# Altium schematic sheet CAN.SchDoc
size A4; SheetNumber: 6; SheetTotal: 7
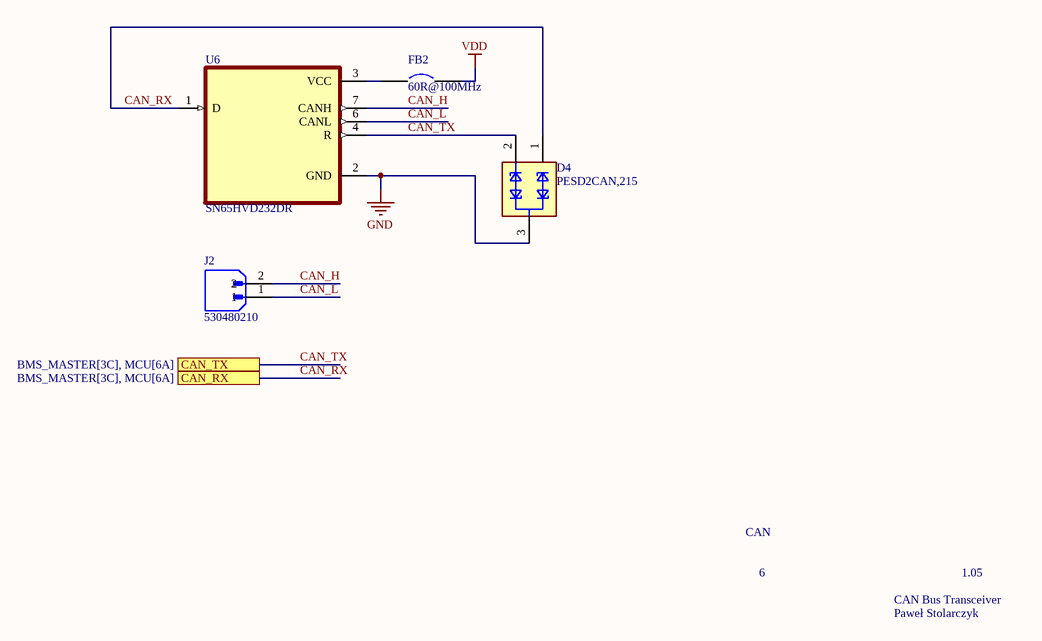
[diagram p0: CAN.SchDoc]

## Parts
D4  PESD2CAN,215  [SOT95P230X110-3N]
FB2  60R@100MHz  [0402]
J2  530480210  [MOLEX_530480210]
U6  SN65HVD232DR  [SOIC127P599X175-8N]

## Ports
CAN_RX (see BMS_MASTER[3C], MCU[6A]), CAN_TX (see BMS_MASTER[3C], MCU[6A])

## Nets
GND: D4.3 U6.2(GND)
VDD: FB2.2
CAN_H: J2.2 U6.7(CANH)
CAN_L: J2.1 U6.6(CANL)
CAN_RX: D4.1 U6.1(D) ; port CAN_RX
CAN_TX: D4.2 U6.4(R) ; port CAN_TX
NetFB2_1: FB2.1 U6.3(VCC)

## Notes on the sheet
- CAN
- 6
- CAN Bus Transceiver
- 1.05
- Paweł Stolarczyk

## Library data of the parts
D4 = PESD2CAN,215: ESD Suppressor Diode TVS Bi-Dir 24V Automotive 3-Pin SOT-23 T/R; MF: Nexperia USA Inc.; SnapEDA_Link: https://www.snapeda.com/parts/PESD2CAN,215/Nexperia/view-part/?ref=snap; Package: TO-236-3 Nexperia USA Inc.; MP: PESD2CAN,215; Check_prices: https://www.snapeda.com/parts/PESD2CAN,215/Nexperia/view-part/?ref=eda; Purchase-URL: https://pricing.snapeda.com/search/part/PESD2CAN,215/?ref=eda; Price: None; Value: *; Availability: In Stock
FB2 = Circuit Breaker: Published: 24-Mar-1999; LatestRevisionDate: 17-Jul-2002; LatestRevisionNote: Re-released for DXP Platform.; PackageReference: SPST-2; Publisher: Altium Limited; PackageDescription: Switch; 2 Leads
J2 = 530480210: Conn Shrouded Header (4 Sides) HDR 2 POS 1.25mm Solder RA Side Entry Thru-Hole PicoBladeâ„¢ Tray; MF: Molex; SnapEDA_Link: https://www.snapeda.com/parts/530480210/Molex/view-part/?ref=snap; Value: *; Purchase-URL: https://pricing.snapeda.com/search/part/530480210/?ref=eda; Check_prices: https://www.snapeda.com/parts/530480210/Molex/view-part/?ref=eda; Availability: In Stock; Price: None; MP: 530480210; Package: None
U6 = SN65HVD232DR: 3.3 V CAN Transceiver 8-SOIC -40 to 85; MF: Texas Instruments; Texas_Instruments-Purchase-URL: https://snapeda.com/shop?store=Texas+Instruments&id=184570; Price: None; Mouser-Purchase-URL: https://snapeda.com/shop?store=Mouser&id=184570; Availability: Good; Package: SOIC-8 Texas Instruments; SnapEDA_Link: https://www.snapeda.com/parts/SN65HVD232DR/Texas%20Instruments/view-part/184570/?ref=snap; DigiKey-Purchase-URL: https://snapeda.com/shop?store=DigiKey&id=184570; MP: SN65HVD232DR; Value: *; Arrow_Electronics-Purchase-URL: https://snapeda.com/shop?store=Arrow+Electronics&id=184570